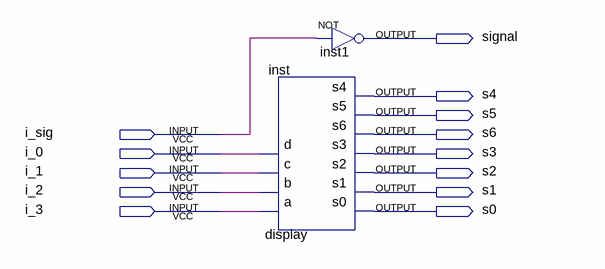
[diagram p0: schematic sheet]
// Quartus schematic display_sinal.bdf as structural Verilog: 2 symbols, 13 pins
module display_sinal (
  input  i_sig,
  input  i_0,
  input  i_1,
  input  i_2,
  input  i_3,
  output signal,
  output s4,
  output s5,
  output s6,
  output s3,
  output s2,
  output s1,
  output s0
);

  display inst (.a(i_3), .b(i_2), .c(i_1), .d(i_0), .s0(s0), .s1(s1), .s2(s2), .s3(s3), .s6(s6), .s5(s5), .s4(s4));
  not inst1 (signal, i_sig);
endmodule
